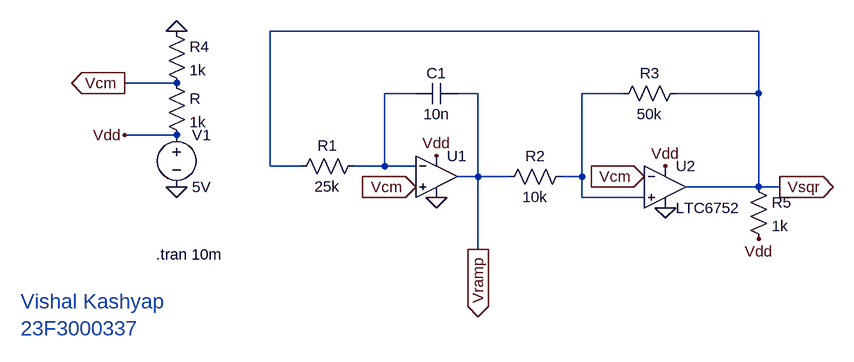
[diagram p0: schematic 01_ramp_generator.asc]
01_ramp_generator.asc, the LTspice schematic file:
Version 4.1
SHEET 1 1008 680
WIRE 864 0 112 0
WIRE -32 80 -112 80
WIRE 336 96 288 96
WIRE 432 96 400 96
WIRE 656 96 592 96
WIRE 864 96 864 0
WIRE 864 96 736 96
WIRE -32 160 -112 160
WIRE 112 208 112 0
WIRE 160 208 112 208
WIRE 288 208 288 96
WIRE 288 208 240 208
WIRE 336 208 288 208
WIRE 432 224 432 96
WIRE 432 224 400 224
WIRE 480 224 432 224
WIRE 592 224 592 96
WIRE 592 224 560 224
WIRE 864 240 864 96
WIRE 864 240 752 240
WIRE 896 240 864 240
WIRE 592 256 592 224
WIRE 688 256 592 256
WIRE 432 336 432 224
FLAG 368 192 Vdd
FLAG 336 240 Vcm
IOPIN 336 240 In
FLAG 368 256 0
FLAG -32 240 0
FLAG -32 0 0
FLAG -112 160 Vdd
FLAG -112 80 Vcm
IOPIN -112 80 Out
FLAG 720 208 Vdd
FLAG 720 272 0
FLAG 432 336 Vramp
IOPIN 432 336 Out
FLAG 688 224 Vcm
IOPIN 688 224 In
FLAG 896 240 Vsqr
IOPIN 896 240 Out
FLAG 864 320 Vdd
SYMBOL OpAmps\\UniversalOpAmp 368 224 R0
SYMATTR InstName U1
SYMBOL res 576 208 R90
WINDOW 0 0 56 VBottom 2
WINDOW 3 32 56 VTop 2
SYMATTR InstName R2
SYMATTR Value 10k
SYMBOL res 752 80 R90
WINDOW 0 0 56 VBottom 2
WINDOW 3 32 56 VTop 2
SYMATTR InstName R3
SYMATTR Value 50k
SYMBOL res 256 192 R90
WINDOW 0 0 56 VBottom 2
WINDOW 3 32 56 VTop 2
SYMATTR InstName R1
SYMATTR Value 25k
SYMBOL cap 400 80 R90
WINDOW 0 0 32 VBottom 2
WINDOW 3 32 32 VTop 2
SYMATTR InstName C1
SYMATTR Value 10n
SYMBOL voltage -32 144 R0
WINDOW 123 0 0 Left 0
WINDOW 39 0 0 Left 0
SYMATTR InstName V1
SYMATTR Value 5V
SYMBOL res -48 64 R0
SYMATTR InstName R
SYMATTR Value 1k
SYMBOL res -48 -16 R0
SYMATTR InstName R4
SYMATTR Value 1k
SYMBOL Comparators\\LTC6752 720 176 R0
SYMATTR InstName U2
SYMBOL res 848 224 R0
SYMATTR InstName R5
SYMATTR Value 1k
TEXT -64 344 Left 2 !.tran 10m
TEXT -272 416 Left 3 ;Vishal Kashyap\n23F3000337

The netlist it stands for:
* 01_ramp_generator.asc
X§U1 Vcm N001 Vdd 0 Vramp level1 Avol=1Meg GBW=10Meg Vos=0 En=0 Enk=0 In=0 Ink=0 Rin=500Meg  ; pins In+ In- V+ V- OUT
R2 N002 Vramp 10k
R3 Vsqr N002 50k
R1 N001 Vsqr 25k
C1 Vramp N001 10n
V1 Vdd 0 5V
R Vcm Vdd 1k
R4 0 Vcm 1k
X§U2 N002 Vcm Vdd 0 Vsqr LTC6752  ; pins In+ In- V+ V- OUT
R5 Vsqr Vdd 1k
.tran 10m
* Vishal Kashyap
* 23F3000337
.lib UniversalOpAmp1.lib
.lib LTC7.lib
.backanno
.end